# Altium schematic sheet Power.SchDoc
size A4; DocumentNumber: 1; SheetNumber: 1; SheetTotal: 4
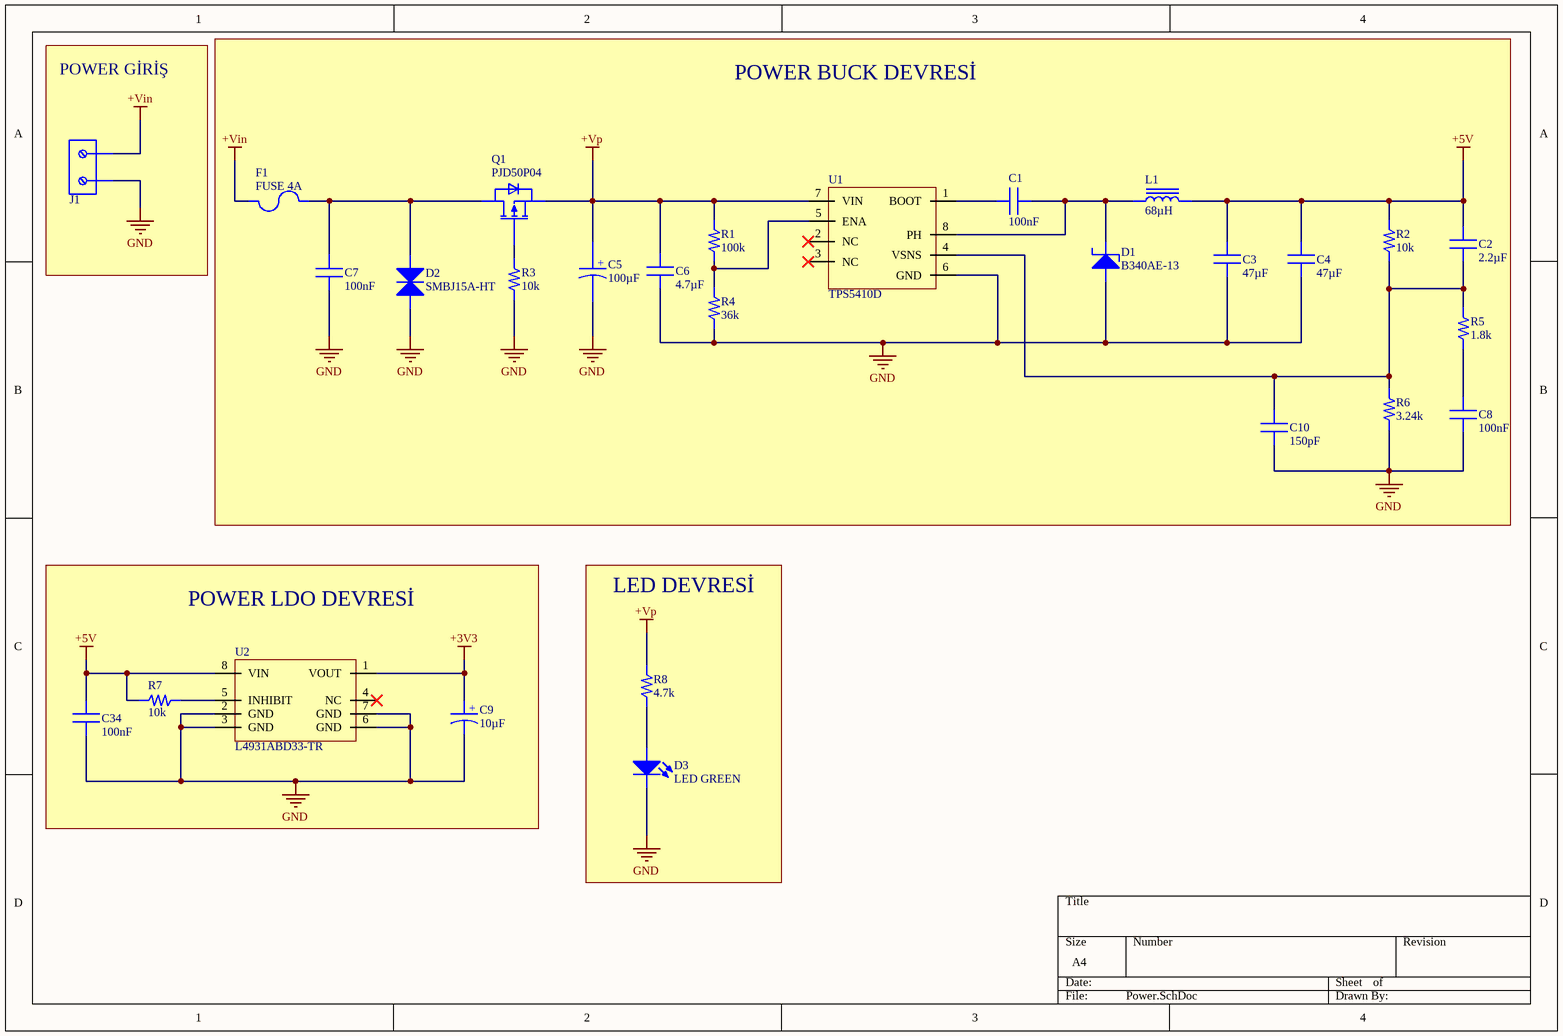
[diagram p0: Power.SchDoc]

## Parts
C1  100nF  [CAP 0603 100NF]
C2  2.2µF  [CAP 0603 2.2uF]
C3  47µF  [CL32A476KOJNNNE]
C4  47µF  [CL32A476KOJNNNE]
C5  100µF  [CAP_EEHZA1H101P]
C6  4.7µF  [CAP 0603 4.7uF]
C7  100nF  [CAP 0603 100NF]
C8  100nF  [CAP 0603 100NF]
C9  10µF  [CAP_EEEFK1H100UR]
C10  150pF  [CAP 0603 150pF]
C34  100nF  [CAP 0603 100NF]
D1  B340AE-13  [DIODE B340AE-13]
D2  SMBJ15A-HT  [TVS DIODE SMBJ15A]
D3  LED GREEN  [LED GREEN 0603 APT1608CGCK]
F1  FUSE 4A  [FUSE 0805 MFU0805FF04000P100]
J1  2x1 5mm T.B.  [Terminal Block 2x1]  (value not drawn)
L1  68µH  [IND CBC3225T680KR 68uH]
Q1  PJD50P04  [TO252 (DPAK) IRFR024NTRPBF]
R1  100k  [RES 0402 ROYALOHM GENERAL]
R2  10k  [RES 0402 ROYALOHM GENERAL]
R3  10k  [RES 0402 ROYALOHM GENERAL]
R4  36k  [RES 0402 ROYALOHM GENERAL]
R5  1.8k  [RES 0402 ROYALOHM GENERAL]
R6  3.24k  [RES 0402 ROYALOHM GENERAL]
R7  10k  [RES 0402 ROYALOHM GENERAL]
R8  4.7k  [ROYALOHM 0603 RES]
U1  TPS5410D  [SOIC127TPS5410DR]
U2  L4931ABD33-TR  [LDO L4931ABD33-TR SOIC8]

## Blocks framed on the sheet
POWER GİRİŞ: J1
POWER BUCK DEVRESİ: C1-C8 C10 D1 D2 F1 L1 Q1 R1-R6 U1
POWER LDO DEVRESİ: C9 C34 R7 U2
LED DEVRESİ: D3 R8

## Nets
+3V3: C9.1 U2.1(VOUT)
+5V: C2.2 C3.2 C4.2 C34.2 L1.2 R2.2 R7.1 U2.8(VIN)
+Vin: F1.2 J1.1
+Vp: C5.1 C6.2 Q1.3(Source) R1.2 R8.2 U1.7(VIN)
GND: C3.1 C4.1 C5.2 C6.1 C7.1 C8.1 C9.2 C10.1 C34.1 D1.A(Anode) D2.1(A) D3.C(Cathode) J1.2 R3.1 R4.1 R6.1 U1.6(GND) U2.2(GND) U2.3(GND) U2.6(GND) U2.7(GND)
NetC1_1: C1.1 U1.1(BOOT)
NetC1_2: C1.2 D1.C(Cathode) L1.1 U1.8(PH)
NetC2_1: C2.1 C10.2 R2.1 R5.2 R6.2 U1.4(VSNS)
NetC7_2: C7.2 D2.2(C) F1.1 Q1.4(Drain)
NetC8_2: C8.2 R5.1
NetD3_A: D3.A(Anode) R8.1
NetQ1_1: Q1.1(Gate) R3.2
NetR1_1: R1.1 R4.2 U1.5(ENA)
NetR7_2: R7.2 U2.5(INHIBIT)

Not connected (* = marked no-connect by the designer): U1 2(NC)* 3(NC)*; U2 4(NC)*

## Notes on the sheet
- (in symbol CAP 10µF Electrolytic) +
- (in symbol CAP 100µF) +

## Library data of the parts
C1 C7 C8 C34 = CAP 0603 100nF: MLCC (1608) 0603 100nF 50VDC ±10% X7R AUTOMOTIVE CL10B104KB85PNC; Manufacturer: SAMSUNG; Operation Temperature: -55 °C ~ +125 °C; Manufacturer Code: CL10B104KB85PNC; Manufacturer Site: https://www.ozdisan.com/en/p/smt-smd-and-mlcc-capacitors-184/samsung-cl10b104kb85pnc-522216; Package / Case: 0603 (1608 Metric); Capacitance: 100nF; Voltage Rating: 50 VDC; Tolerance: ±10 %; Dielectric Material: X7R; Mounting Type: SMT
C2 = CAP 0603 2.2uF: MLCC (1608) 0603 2.2uF 16VDC ±10% X5R CL10A225KO8NNNC; Manufacturer: SAMSUNG; Operation Temperature: -55 °C ~ +85 °C; Mounting Type: SMT; Dielectric Material: X5R; Tolerance: ±10 %; Voltage Rating: 16 VDC; Capacitance: 2.2µF; Package / Case: 0603 (1608 Metric); Manufacturer Site: https://www.ozdisan.com/en/p/smt-smd-and-mlcc-capacitors-184/samsung-cl10a225ko8nnnc-497655; Manufacturer Code: CL10A225KO8NNNC
C3 C4 = CAP 1210 47µF: MLCC 1210 47uF 16VDC ±10% X5R   CL32A476KOJNNNE; Manufacturer: SAMSUNG; Operation Temperature: -55 °C ~ +85 °C; Capacitance: 47µF; Voltage Rating: 16 VDC; Tolerance: ±10 %; Dielectric Material: X5R; Manufacturer Site: https://www.ozdisan.com/en/p/smt-smd-and-mlcc-capacitors-184/samsung-cl32a476kojnnne-423179; Manufacturer Code: CL32A476KOJNNNE
C5 = CAP 100µF: CAP.EL.100µF 50V 10.5x10.5 105C SMD; Manufacturer: Panasonic; Manufacturer Code: EEH-ZA1H101P; Capacitor Type: Hybrid; Voltage Value: 50VDC; Tolerance: ±20 %; Surge Current: 2 A; Capacitance: 100µF; Package: Radial; Operating Temp.: -55 °C ~ +105 °C; Manufacturer Site: https://www.ozdisan.com/p/aluminyum-kapasitorler-180/panasoniceurope-eehza1h101p-614536
C6 = CAP 0603 4.7uF CL10A475KL8NRNC: MLCC (1608) 0603 4.7uF 35VDC ±10% X5R CL10A475KL8NRNC; Manufacturer: SAMSUNG; Operation Temperature: -55 °C ~ +85 °C; Manufacturer Site: https://www.ozdisan.com/en/p/smt-smd-and-mlcc-capacitors-184/samsung-cl10a475kl8nrnc-620226; Manufacturer Code: CL10A475KL8NRNC; Package / Case: 0603 (1608 Metric); Capacitance: 4.7µF; Voltage Rating: 35 VDC; Tolerance: ±10 %; Dielectric Material: X5R; Mounting Type: SMT
C9 = CAP 10µF Electrolytic: CAP.EL.10uF 50V 5x5.8 105C 2000H AEC-Q200 SMT; Manufacturer: PANASONIC; Manufacturer Code: EEEFK1H100UR; Voltage Rating: 50 VDC; Tolerance: ±20 %; Capacitance: 10µF; Capacitor Type: Electrolytic; Operating Temperature: 85 mA; Manufacturer Site: https://www.ozdisan.com/en/p/aluminyum-kapasitorler-180/panasoniceurope-eeefk1h100ur-1102281
C10 = CAP 0603 150pF: MLCC (1608) 0603 150pF 50VDC ±5% C0G (NP0) CL10C151JB8NNNC; Manufacturer: SAMSUNG; Operation Temperature: -55 °C ~ +125 °C; Manufacturer Code: CL10C151JB8NNNC; Manufacturer Site: https://www.ozdisan.com/en/p/smt-smd-and-mlcc-capacitors-184/samsung-cl10c151jb8nnnc-29957; Capacitance: 150pF; Package / Case: 0603 (1608 Metric); Voltage Rating: 50 VDC; Tolerance: ±5 %; Dielectric Material: C0G (NP0); Mounting Type: SMT
D1 = DIODE SCHOTTKY B340AE-13: DIODE SCHOTTKY 3A 40V SMA DO-214AC; Manufacturer: DIODES; Non-Repetitive Peak Forward Surge Current: 80A; Forward Voltage Drop: 0.45V; Peak Repetitive Reverse Voltage (VRRM): 40V; Average Rectified Current: 3A; Operating Temperature: -55 °C ~ +150 °C; Manufacturer Site: https://www.ozdisan.com/en/p/schottky-diodes-385/diodes-b340ae-13-736716; Manufacturer Code: B340AE-13
D2 = DIODE TVS SMBJ15A-HT: DIODE TVS 600W 15V DO214AA SMB; pin to pad: 1>A 2>C; Manufacturer: HOTTECH; Direction: Uni-Direction; Peak Pulse Current: 24.6; Manufacturer Site: https://www.ozdisan.com/p/TVS-Diodes-386/hottech-smbj15a-ht-503592?gad_source=1&gad_campaignid=22862662318&gbraid=0AAAAADZaco9GRDpwp6nwxImxnSPU74-HV&gclid=CjwKCAiAmp3LBhAkEiwAJM2JUNsfUTvu17OkGEIhWr_5BT7x3v2LizKiIaGxyMlL1g7MMILW0EtdSxoCxEMQAvD_BwE; Category: TVS; Vwm: 15V; Operating Temp.: -55 °C ~ +150 °C; Manufacturer Code: SMBJ15A-HT
D3 = SMD LED GREEN APT1608CGCK: LED GREEN CLEAR CHIP SMD; Manufacturer: KINGBRIGHT; Max Power: 75 mW; Light Intensity: 18 - 35 cmd; Transmission Voltage: 2.1 - 2.5V; Transmission Current: 30 mA; Manufacturer Site: https://www.ozdisan.com/p/sinyal-ledler-tek-renkli-361/kingbright-apt1608cgck-1050108; Color: Green; Package Size: 0603; Operating Temp.: -30 °C ~ +85 °C; Manufacturer Code: APT1608CGCK
F1 = FUSE: FUSE BOARD MOUNT 0805 4A 32VDC; Manufacturer: VISHAY; Manufacturer Code: MFU0805FF04000P100; Breaking Capacity: 50A; Mounting Type: SMT; Fuse Type: Fuse Board; Current Rating: 4A; Voltage Rating: 32VDC; Operating Temp.: -55°C~+125 °C; Manufacturer Site: https://www.ozdisan.com/p/sigortalar-849/vishay-mfu0805ff04000p100-617478
J1 = Terminal Block 2x1: TERM.BLK.5.00MM 2P PCB TYPE 0 BOY BLUE; Manufacturer: DEGSON; Manufacturer Code: DG301-5.0-02P-12-00AH; Voltage Rating: 300V; Current Rating: 15A; Mounting Type: THT; Number of Pins: 2; Operating Temp.: -40°C~+105 °C; Manufacturer Site: https://www.ozdisan.com/p/pcb-klemensler-410/degson-dg301-5-0-02p-12-00ah-349366
L1 = INDUCTOR 68µH SMD 744066680: INDUCTOR FIXED 68UH 10x10mm SMD 744066680; Manufacturer: WURTH; Tolerance: ±30 %; Current Rating: 1.5A; DC Resistance (DCR): 185 m Ohms; Manufacturer Site: https://www.ozdisan.com/p/sabit-induktorler-468/wurth-744066680-635583; Inductance: 68µH; Operating Temperature: -40 °C ~ +125 °C; Manufacturer Code: 744066680
Q1 = P-CH Mosfet 40V 9A PJD50P04-AU_L2_000A1: MOSFET DIS.50A 40V P-CH AUTOMOTIVE TO-252AA SMT; Manufacturer: PANJIT; Power Dissipation: 70 W; Rds On: 10 m Ohms; Current (25°C): 50 A; Voltage: 40 V; Fet Type: P-CH; Package / Case: TO252 (DPAK); Mounting Type: SMT; Manufacturer Site: https://www.ozdisan.com/en/p/discrete-mosfets-435/panjit-pjd50p04-au-l2-000a1-979715; Manufacturer Code: PJD50P04-AU_L2_000A1
R1 = RES 0402 100k 0402WGF1003TCE: RES.(1005) 0402 100K Ohms 1% 1/16W 100PPM / 0402WGF1003TCE; Manufacturer: ROYALOHM; Tolerance: ±5 %; Max Working Current: 1A; Max Working Voltage: 50V; Manufacturer Site: https://www.ozdisan.com/p/smt-smd-ve-cip-direncler-194/royalohm-0402wgf1003tce-359898; Power: 1/16 W; Package / Case: 0402; Manufacturer Code: 0402WGF1003TCE; Resistance Value: 100 k Ohms
R2 R3 R7 = RES 0402 10k: RES.(1005) 0402 10K Ohms 5% 1/16W 100PPM 0402WGJ0103TCE; Manufacturer: ROYALOHM; Tolerance: %5; Voltage Rating: 5V; Manufacturer Site: https://www.ozdisan.com/p/smt-smd-ve-cip-direncler-194/royalohm-0402wgj0103tce-362331; Package Size: 0402; Manufacturer Code: 0402WGJ0103TCE; Power: 1/16W; Resistance Value: 10k Ohms
R4 = RES 0402 36k 0402WGF3602TCE: RES.(1005) 0402 36K Ohms 1% 1/16W 100PPM 0402WGF3602TCE; Manufacturer: ROYALOHM; Power: 1/16 W-S; Max. Working Voltage: 50V; Max. Working Current: 1A; Manufacturer Site: https://www.ozdisan.com/p/smt-smd-ve-cip-direncler-194/royalohm-0402wgf3602tce-359889; Resistance Value: 36 k Ohms; Tolerance: ±1 %; Manufacturer Code: 0402WGF3602TCE
R5 = RES 0402 1.8k 0402WGJ0182TCE: RES.(1005) 0402 1.8K Ohms 5% 1/16W 100PPM 0402WGJ0182TCE; Manufacturer: ROYALOHM; Working Voltage: 50 V; Tolerance: ±5 %; Resistance Value: 1.8 k Ohms; Power: 1/16 W; Manufacturer Code: 0402WGJ0182TCE; Manufacturer Site: https://www.ozdisan.com/p/smt-smd-ve-cip-direncler-194/royalohm-0402wgj0182tce-506663
R6 = RES 0402 3.24k 0402WGF3241TCE: RES 0805 3.24k Ohms 1% 1/8W-S 100PPM 0402WGF3241TCE; Manufacturer: ROYALOHM; Power: 1/16 W-S; Working Voltage: 50V; Max Working Current: 1A; Manufacturer Site: https://www.ozdisan.com/p/smt-smd-ve-cip-direncler-194/royalohm-0402wgf3241tce-506267; Resistance Value: 3.24 k Ohms; Tolerance: ±1 %; Manufacturer Code: 0402WGF3241TCE
R8 = RES 0402 4.7k 0603SAJ0472T5E: RES.(1608) 0603 4.7K Ohms 5% 1/10W-S 100PPM 0603SAJ0472T5E; Manufacturer: ROYALOHM; Voltage Rating: 50V; Power: 1/16W; Package Size: 0402; Tolerance: ±5 %; Manufacturer Site: https://www.ozdisan.com/p/smt-smd-ve-cip-direncler-194/royalohm-0603saj0472t5e-336241; Manufacturer Code: 0603SAJ0472T5E; Resistance Value: 4.7k Ohms
U1 = Buck Converter TPS5410D: IC-5410DR REG BUCK ADJ 1A 8SOIC SMD TI; Manufacturer: TEXAS TI; Switching Function: Step-Down; Output Type: Adjustable; Input Voltage: 5.5 to 36 V; Switching Frequency: 500 kHz; Mounting Type: SMT; Package / Case: SOIC8; Output Voltage: Output Voltage; Output Current: 1A; Operating Temperature: -40 °C ~ +125 °C; Manufacturer Site: https://www.ozdisan.com/en/p/dc-dc-voltaj-regulatorleri-275/texas-tps5410dr-442302; Manufacturer Code: TPS5410D
U2 = LDO L4931ABD33: IC REG LINEAR 3.3V 250MA 8SO L4931ABD33; Manufacturer: STM; Input Voltage (Operating): 4 to 20 V; Output Voltage: 3.3 V; Output Current: 250 mA; Operating Temperature: -40 °C ~ +125 °C; Manufacturer Site: https://www.ozdisan.com/en/p/linear-voltage-regulators-279/stm-l4931abd33-tr-1325219; Manufacturer Code: L4931ABD33